# EAGLE schematic Logic (EAGLE 6.4)
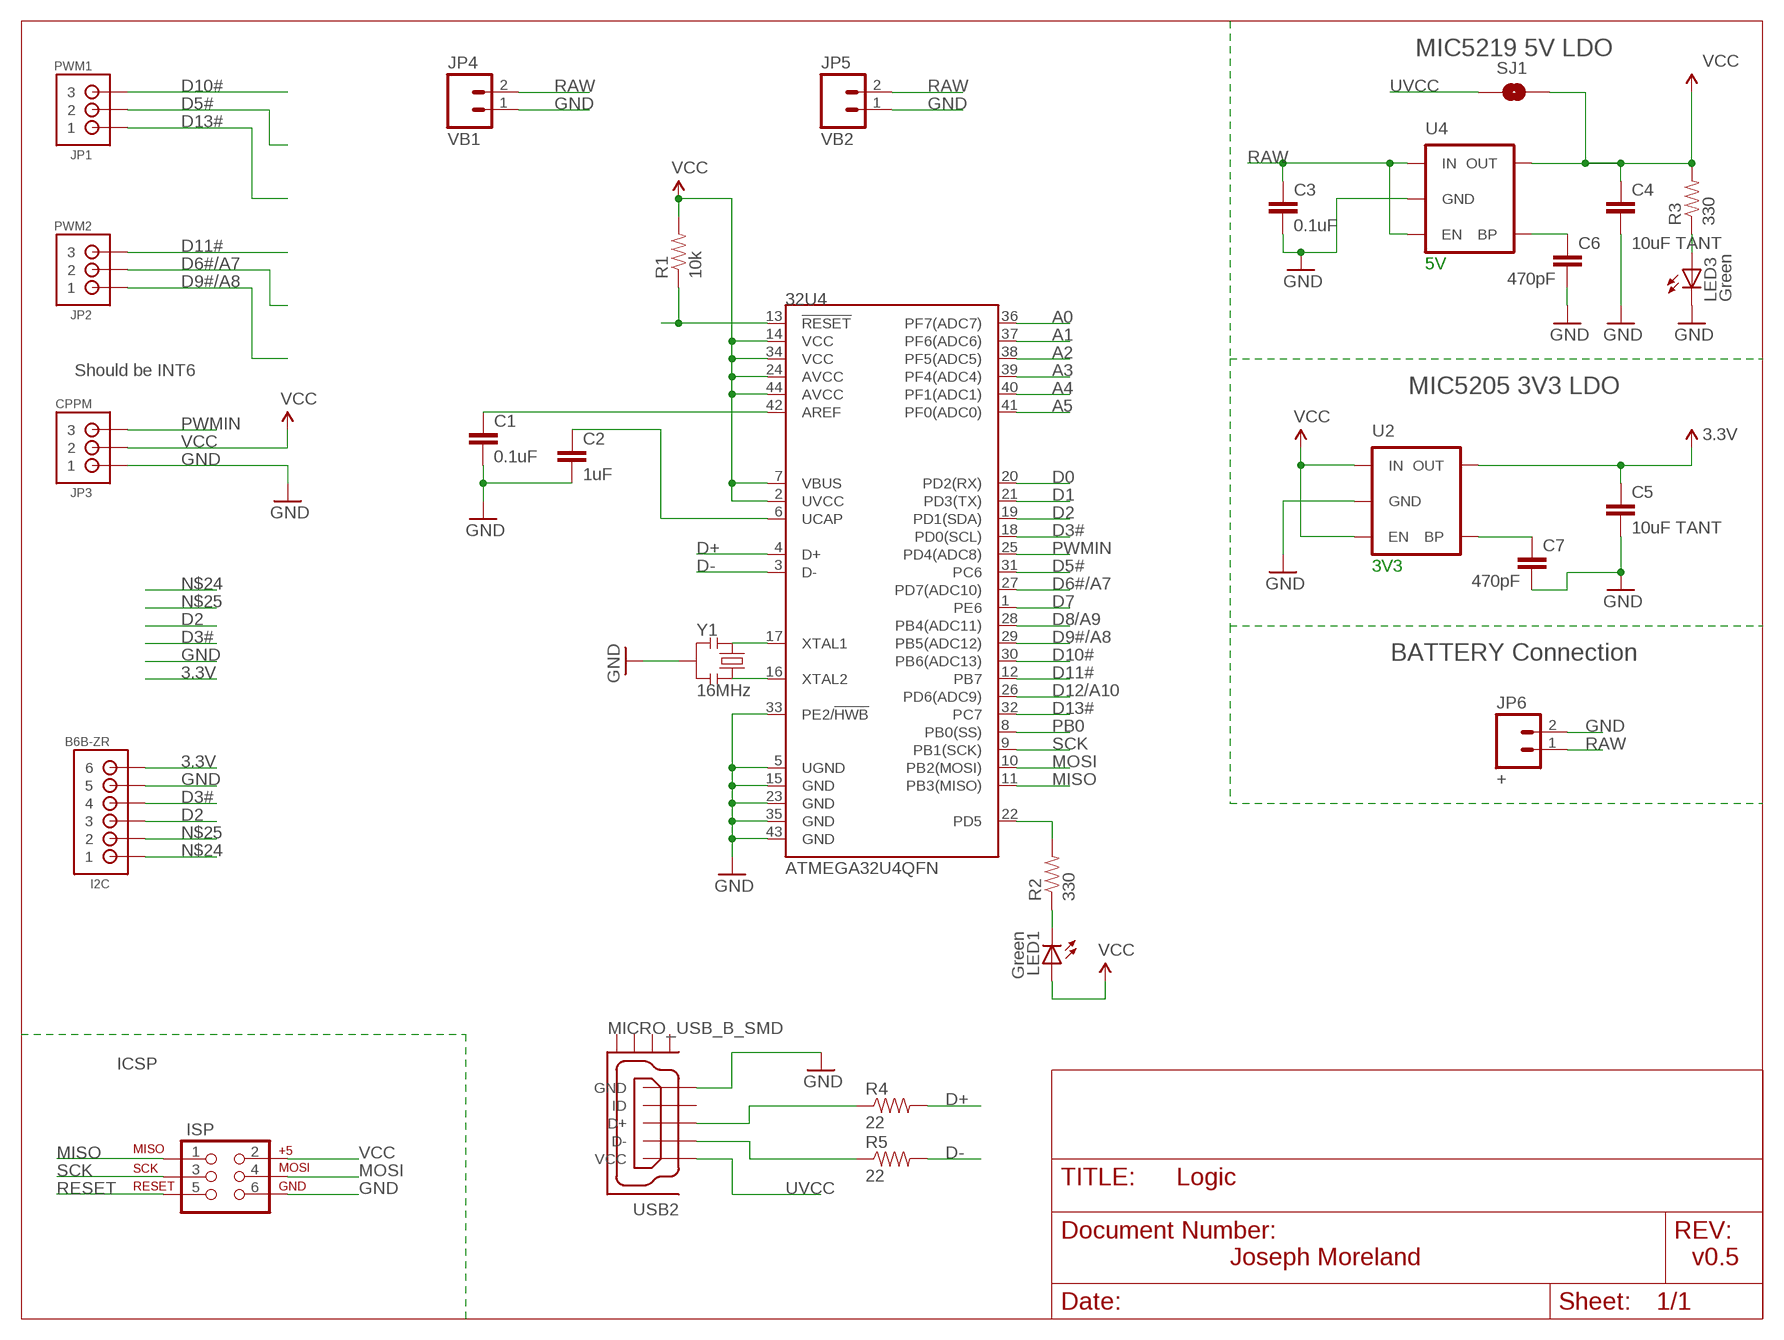
[diagram p0: schematic, sheet 1]

## Parts
32U4  ATMEGA32U4QFN  [SPARKFUN-DIGITALIC_QFN-44]
C1  0.1uF  CAP0603-CAP  [0603-CAP]
C2  1uF  CAP0402-CAP  [0402-CAP]
C3  0.1uF  CAP0603-CAP  [0603-CAP]
C4  10uF TANT  CAP0603-CAP  [0603-CAP]
C5  10uF TANT  CAP0603-CAP  [0603-CAP]
C6  470pF  CAP0603-CAP  [0603-CAP]
C7  470pF  CAP0603-CAP  [0603-CAP]
I2C  B6B-ZR  [B6B-ZR]
ISP  ICSP  AVR_SPI_PRG_62X3_LOCK  [2X3_LOCK]
JP1  PWM1  B3B-ZR  [B3B-ZR]
JP2  PWM2  B3B-ZR  [B3B-ZR]
JP3  CPPM  B3B-ZR  [B3B-ZR]
JP4  VB1  M02LOCK  [1X02_LOCK]
JP5  VB2  M02LOCK  [1X02_LOCK]
JP6  +  M02LOCK  [1X02_LOCK]
LED1  Green  LED0603  [LED-0603]
LED3  Green  LED0603  [LED-0603]
R1  10k  RESISTOR0402-RES  [0402-RES]
R2  330  RESISTOR0402-RES  [0402-RES]
R3  330  RESISTOR0402-RES  [0402-RES]
R4  22  RESISTOR0402-RES  [0402-RES]
R5  22  RESISTOR0402-RES  [0402-RES]
SJ1  SOLDERJUMPERNO  [SJ_2S-NO]
U2  MIC52053v3  V_REG_LDOSMD  [SOT23-5]
U4  MIC5219 5V  V_REG_MIC52195V  [SOT23-5]
USB2  MICRO_USB_B_SMD  [MOLEX_MICRO_USB_B_BOTTOM_MOUNT]
Y1  16MHz  RESONATOR16MHZ  [RESONATOR-SMD]

## Nets
3.3V: C5.1 I2C.6 U2.5(OUT)
A0: 32U4.36(PF7(ADC7))
A1: 32U4.37(PF6(ADC6))
A2: 32U4.38(PF5(ADC5))
A3: 32U4.39(PF4(ADC4))
A4: 32U4.40(PF1(ADC1))
A5: 32U4.41(PF0(ADC0))
AREF: 32U4.42(AREF) C1.1
D0: 32U4.20(PD2(RX))
D1: 32U4.21(PD3(TX))
D2: 32U4.19(PD1(SDA)) I2C.3
D3#: 32U4.18(PD0(SCL)) I2C.4
D5#: 32U4.31(PC6) JP1.2
D6#/A7: 32U4.27(PD7(ADC10)) JP2.2
D7: 32U4.1(PE6)
D8/A9: 32U4.28(PB4(ADC11))
D9#/A8: 32U4.29(PB5(ADC12)) JP2.1
D10#: 32U4.30(PB6(ADC13)) JP1.3
D11#: 32U4.12(PB7) JP2.3
D12/A10: 32U4.26(PD6(ADC9))
D13#: 32U4.32(PC7) JP1.1
D+: 32U4.4(D+) R4.2
D-: 32U4.3(D-) R5.2
GND: 32U4.5(UGND) 32U4.15(GND) 32U4.23(GND) 32U4.33(PE2/!HWB) 32U4.35(GND) 32U4.43(GND) C1.2 C2.2 C3.2 C4.2 C5.2 C6.2 C7.2 I2C.5 ISP.6 JP3.1 JP4.1 JP5.1 JP6.2 LED3.C U2.2(GND) U4.2(GND) USB2.5(GND) Y1.2
MISO: 32U4.11(PB3(MISO)) ISP.1
MOSI: 32U4.10(PB2(MOSI)) ISP.4
N$1: R4.1 USB2.3(D+)
N$2: C6.1 U4.4(BP)
N$3: 32U4.17(XTAL1) Y1.1
N$4: C7.1 U2.4(BP)
N$6: 32U4.16(XTAL2) Y1.3
N$8: LED1.C R2.1
N$10: LED3.A R3.1
N$11: R5.1 USB2.2(D-)
N$24: I2C.1
N$25: I2C.2
N$33: 32U4.22(PD5) R2.2
PB0: 32U4.8(PB0(SS))
PWMIN: 32U4.25(PD4(ADC8)) JP3.3
RAW: C3.1 JP4.2 JP5.2 JP6.1 U4.1(IN) U4.3(EN)
RESET: 32U4.13(!RESET) ISP.5 R1.1
SCK: 32U4.9(PB1(SCK)) ISP.3
UCAP: 32U4.6(UCAP) C2.1
UVCC: SJ1.1 USB2.1(VCC)
VCC: 32U4.2(UVCC) 32U4.7(VBUS) 32U4.14(VCC) 32U4.24(AVCC) 32U4.34(VCC) 32U4.44(AVCC) C4.1 ISP.2 JP3.2 LED1.A R1.2 R3.2 SJ1.2 U2.1(IN) U2.3(EN) U4.5(OUT)
Unconnected: USB2.4(ID) USB2.GND1 USB2.GND2 USB2.GND3 USB2.GND4

## Notes on the sheet
- MIC5219 5V LDO
- 5V
- Should be INT6
- MIC5205 3V3 LDO
- 3V3
- BATTERY Connection
- Joseph Moreland | v0.5

## Library data of the parts
32U4 = SparkFun-DigitalIC:ATMEGA32U4: Atmel 44-pin 8-bit Microcontroller with 32KBytes of ISP Flash and USB Controller; PARTNO: ATMEGA32U4-MU
C1 C3 = SparkFun-Capacitors:CAP: Capacitor Standard 0603 ceramic capacitor, and 0.1" leaded capacitor.; PARTNO: C0603C104K8RACTU
C2 = SparkFun-Capacitors:CAP: Capacitor Standard 0603 ceramic capacitor, and 0.1" leaded capacitor.; PARTNO: LMK105BJ105KV-F
C4 C5 = SparkFun-Capacitors:CAP: Capacitor Standard 0603 ceramic capacitor, and 0.1" leaded capacitor.; PARTNO: TCM1A106M8R
C6 C7 = SparkFun-Capacitors:CAP: Capacitor Standard 0603 ceramic capacitor, and 0.1" leaded capacitor.; PARTNO: C0603C471K5RACTU
I2C = jst-zh-dl:B6B-ZR: JST-ZH Connector 6 pol, 1.5mm pitch Package: B6B-ZR Source: http://www.jst-mfg.com/product/pdf/eng/eZH.pdf
ISP = SparkFun-Connectors:AVR_SPI_PRG_6: AVR ISP 6 Pin This is the reduced ISP connector for AVR programming. Common on Arduino. This footprint will take up less PCB space and can be used with a 10-pin to 6-pin adapter such as SKU: BOB-08508
JP1-JP3 = jst-zh-dl:B3B-ZR: JST-ZH Connector 3 pol, 1.5mm pitch Package: B3B-ZR Source: http://www.jst-mfg.com/product/pdf/eng/eZH.pdf; PARTNO: M20-9990346
JP4-JP6 = SparkFun-Connectors:M02: Header 2 Standard 2-pin 0.1" header. Use with straight break away headers (SKU : PRT-00116), right angle break away headers (PRT-00553), swiss pins (PRT-00743), machine pins (PRT-00117), and female headers (PRT-00115). Molex polarized connector foot print use with SKU : PRT-08233 with associated crimp pins and housings.; PARTNO: 22-28-4025
LED1 LED3 = SparkFun-LED:LED: LEDs Standard schematic elements and footprints for 5mm, 3mm, 1206, and 0603 sized LEDs. 5mm - Spark Fun Electronics SKU : COM-00529 (and others); PARTNO: LTST-C190KGKT
R1 = SparkFun-Resistors:RESISTOR: Resistor Basic schematic elements and footprints for 0603, 1206, and PTH resistors.; PARTNO: CRCW040210K0FKED
R2 R3 = SparkFun-Resistors:RESISTOR: Resistor Basic schematic elements and footprints for 0603, 1206, and PTH resistors.; PARTNO: CRCW0402330RJNED
R4 R5 = SparkFun-Resistors:RESISTOR: Resistor Basic schematic elements and footprints for 0603, 1206, and PTH resistors.; PARTNO: CRCW040222R0JNED
SJ1 = SparkFun-Passives:SOLDERJUMPER: Solder Jumper Standard SMD solder jumper. Used to automate production. Two varients : Normally Open and Normally Closed are the same, but have different paste layers. NC will have a large amount of paste and should jumper during reflow.; PARTNO: DNP
U2 = SparkFun-PowerIC:V_REG_LDO: Voltage Regulator LDO Standard 150mA LDO voltage regulator in SOT-23 layout. Micrel part MIC5205. BP (by-pass) pin is used to lower output noise with 470pF cap.; PARTNO: MIC5205-3.3YM5 TR
U4 = SparkFun-PowerIC:V_REG_MIC5219: V_REG MIC5219 Standard 500mA LDO voltage regulator in SOT-23 layout. Micrel part MIC5219. BP (by-pass) pin is used to lower output noise with 470pF cap, may be left open.; PARTNO: MIC5219-5.0YM5 TR; PROD_ID: VREG-10107
USB2 = JCM:MICRO_USB_B_SMD: Molex Micro USB B Receptacle, bottom mount Micro-USB technology was developed by the USB Implementers Forum, Inc. (USB-IF), an independent nonprofit group that advances USB technology. Molex's Micro-USB connectors offer advantages of smaller size and increased durability compared with the Mini-USB. Micro-USB connectors allow manufacturers to push the limits of thinner and lighter mobile devices with sleeker designs and greater portability.; DATASHEET: http://www.molex.com/webdocs/datasheets/pdf/en-us/0473460001_IO_CONNECTORS.pdf; LINK: http://www.molex.com/molex/products/family?key=micro_usb&channel=products&chanName=family&pageTitle=Introduction; MFGPN: 47346-0001; PARTNO: 473460001
Y1 = SparkFun-FreqCtrl:RESONATOR: Resonator Small SMD resonator. Used, eg, on the Arduino Pro/ Pro Mini boards. 8MHz- XTAL-08895 16MHz- XTAL-08900; PARTNO: CSTCE16M0V53-R0; PROD_ID: XTAL-08900